# Altium schematic sheet adc-ADS7952.SchDoc: ADS7952
size A4; DrawnBy: Dylan Vogel; Organization: UTAT SS; Revision: 1.1
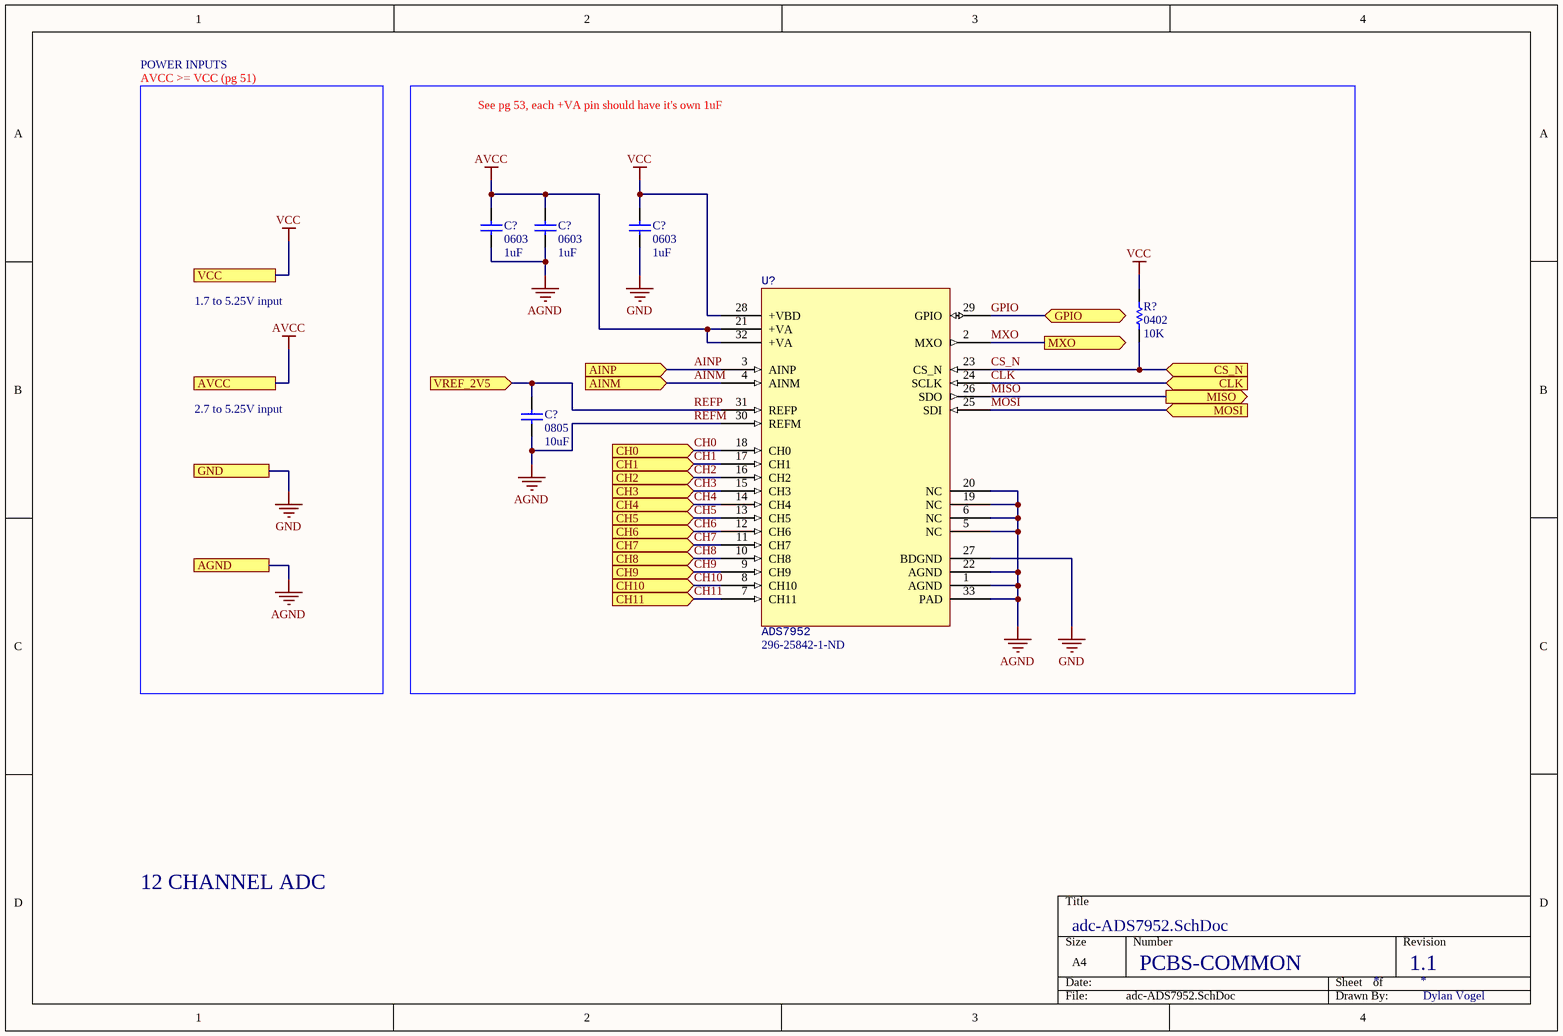
[diagram p0: adc-ADS7952.SchDoc]

## Parts
(Parts that share a designator on the sheet are numbered #1, #2 ... from top to bottom, then left to right.)
C?#1  0603  value 1uF  [CAP0603R]
C?#2  0603  value 1uF  [CAP0603R]
C?#3  0603  value 1uF  [CAP0603R]
C?#4  0805  value 10uF  [CAP0805R]
R?  0402  value 10K  [RES0402R]
U?  ADS7952  Supplier Part Number 1: 296-25842-1-ND  [QFN50P500X500X100-33]

## Blocks framed on the sheet
See pg 53, each +VA pin should have it's own 1uF: C?#1-C?#4 R? U?

## Ports
AGND, AINM (in), AINP (in), AVCC, CH0 (in), CH1 (in), CH2 (in), CH3 (in), CH4 (in), CH5 (in), CH6 (in), CH7 (in), CH8 (in), CH9 (in), CH10 (in), CH11 (in), CLK (in), CS_N (in), GND, GPIO (bidir), MISO (out), MOSI (in), MXO (out), VCC, VREF_2V5 (in)

## Nets
AVCC: C?#1.2 C?#2.2 U?.21(+VA) U?.32(+VA) ; port AVCC
GND: C?#3.1 U?.27(BDGND) ; port GND
REFM: C?#1.1 C?#2.1 C?#4.1 U?.1(AGND) U?.5(NC) U?.6(NC) U?.19(NC) U?.20(NC) U?.22(AGND) U?.30(REFM) U?.33(PAD) ; port AGND  [also labelled AGND]
VCC: C?#3.2 R?.2 U?.28(+VBD) ; port VCC
AINM: U?.4(AINM) ; port AINM
AINP: U?.3(AINP) ; port AINP
CH0: U?.18(CH0) ; port CH0
CH1: U?.17(CH1) ; port CH1
CH2: U?.16(CH2) ; port CH2
CH3: U?.15(CH3) ; port CH3
CH4: U?.14(CH4) ; port CH4
CH5: U?.13(CH5) ; port CH5
CH6: U?.12(CH6) ; port CH6
CH7: U?.11(CH7) ; port CH7
CH8: U?.10(CH8) ; port CH8
CH9: U?.9(CH9) ; port CH9
CH10: U?.8(CH10) ; port CH10
CH11: U?.7(CH11) ; port CH11
CLK: U?.24(SCLK) ; port CLK
CS_N: R?.1 U?.23(CS_N) ; port CS_N
GPIO: U?.29(GPIO) ; port GPIO
MISO: U?.26(SDO) ; port MISO
MOSI: U?.25(SDI) ; port MOSI
MXO: U?.2(MXO) ; port MXO
REFP: C?#4.2 U?.31(REFP) ; port VREF_2V5

## Notes on the sheet
- POWER INPUTS
- AVCC >= VCC (pg 51)
- 1.7 to 5.25V input
- 2.7 to 5.25V input
- 12 CHANNEL ADC
- PCBS-COMMON

## Library data of the parts
C?#1-C?#3 = CAP0603: 0603 capacitor; Manufacturer: KEMET; Manufacturer Part Number: C0603C105K4RACAUTO; Description: CAP CER 0603 1UF 16V X7R 10%; Tolerance: 10%; Voltage Rating: 16V; Supplier 1: Digi-Key; Supplier Part Number 1: 399-17704-1-ND; Stock 1: 376276; Pricing 1: 1=0.17, 10=0.12, 100=0.0564, 500=0.03952, 1000=0.03273 (USD); Mount: Surface Mount; Case/Package: 0603; Case Code (Imperial): 0603; Case Code (Metric): 1608; Min Operating Temperature: -55°C; Max Operating Temperature: 125°C; Packaging: Cut Tape; Capacitance: 1uF; Ratings: AEC-Q200
C?#4 = CAP0805: 0805 capacitor; Manufacturer: Murata; Manufacturer Part Number: GCM21BR70J106KE22K; Description: Cap Ceramic 10uF 6.3V X7R 10% SMD 0805 125C Embossed T/R; Tolerance: 10%; Dielectric: X7R; Voltage Rating (DC): 6.3V; Supplier 1: Digi-Key; Supplier Part Number 1: 490-14361-1-ND; Stock 1: 214938; Pricing 1: 1=0.42, 10=0.29, 100=0.1742, 500=0.13064, 1000=0.11031, 2500=0.10451, 5000=0.0987 (USD); Case/Package: 0805; Min Operating Temperature: -55°C; Max Operating Temperature: 125°C; Capacitance: 10uF; Packaging: Tape and Reel; Length: 2mm; Depth: 1.25mm; Lead Free: Lead Free
R? = RES0402: 0402 resistor; Manufacturer: Panasonic; Manufacturer Part Number: ERJ-2RKF1002X; Description: RES SMD 10K OHM 1% 1/10W 0402; Resistance: 10kR; Power Rating: 100mW; Tolerance: 1%; Voltage Rating: 50V; Temperature Coefficient: 100ppm/°C; Supplier 1: Digi-Key; Supplier Part Number 1: P10.0KLCT-ND; Stock 1: 14350001; Pricing 1: 1=0.1, 10=0.045, 100=0.0183, 1000=0.00823, 2500=0.00715, 5000=0.0059 (USD); Mount: Surface Mount; Case/Package: 0402; Number of Pins: 2; Case Code (Metric): 1005; Case Code (Imperial): 0402; Contact Plating: Tin; Min Operating Temperature: -55°C; Max Operating Temperature: 155°C; Packaging: Tape and Reel; Package Quantity: 1; Composition: Thick Film; Number of Terminations: 2; Termination: SMD/SMT; Military Standard: Not; Max Power Dissipation: 100mW; Voltage Rating (DC): 50V; Features: Automotive AEC-Q200; Length: 1mm; Height: 0.35mm; Width: 0.02inch; Depth: 0.5mm; Radiation Hardening: No; REACH SVHC: No SVHC; Lead Free: Lead Free; ComponentLink1URL: http://industrial.panasonic.com/www-data/pdf/AOA0000/AOA0000CE2.pdf?src-supplier=Future+Electronics; ComponentLink1Description: http://industrial.panasonic.com/www-data/pdf/AOA0000/AOA0000CE2.pdf?src-supplier=Future+Electronics; ComponentLink2URL: http://industrial.panasonic.com/www-data/pdf/AOA0000/AOA0000CE2.pdf?src-supplier=Avnet+Europe; ComponentLink2Description: http://industrial.panasonic.com/www-data/pdf/AOA0000/AOA0000CE2.pdf?src-supplier=Avnet+Europe; ComponentLink3URL: https://industrial.panasonic.com/cdbs/www-data/pdf/RDA0000/DMA0000COL11.pdf?src-supplier=Mouser; ComponentLink3Description: https://industrial.panasonic.com/cdbs/www-data/pdf/RDA0000/DMA0000COL11.pdf?src-supplier=Mouser; ComponentLink4URL: http://www.farnell.com/datasheets/1678782.pdf?src-supplier=Element14; ComponentLink4Description: http://www.farnell.com/datasheets/1678782.pdf?src-supplier=Element14; ComponentLink5URL: http://www.farnell.com/datasheets/1911175.pdf?src-supplier=Farnell; ComponentLink5Description: http://www.farnell.com/datasheets/1911175.pdf?src-supplier=Farnell; ComponentLink6URL: http://www.jameco.com/Jameco/Products/ProdDS/1987020.pdf?src-supplier=Jameco; ComponentLink6Description: http://www.jameco.com/Jameco/Products/ProdDS/1987020.pdf?src-supplier=Jameco; ComponentLink7URL: http://industrial.panasonic.com/www-data/pdf/AOA0000/AOA0000CE2.pdf?src-supplier=Avnet; ComponentLink7Description: http://industrial.panasonic.com/www-data/pdf/AOA0000/AOA0000CE2.pdf?src-supplier=Avnet; ComponentLink8URL: http://www.alliedelec.com/m/d/623f45ff1957d936ff56d46fd1c28cac.pdf?src-supplier=Allied+Electronics; ComponentLink8Description: http://www.alliedelec.com/m/d/623f45ff1957d936ff56d46fd1c28cac.pdf?src-supplier=Allied+Electronics
U? = ADS7952: 12 bit, 12 channel analog-to-digital converter with SPI interface.; Supplier 1: Digi-Key